# Altium schematic sheet Relay.SchDoc
size A4; Organization: Q-Tech Design; Address1: Da Nang City; Address2: Viet Nam; DocumentNumber: 6; SheetNumber: 6; SheetTotal: 7
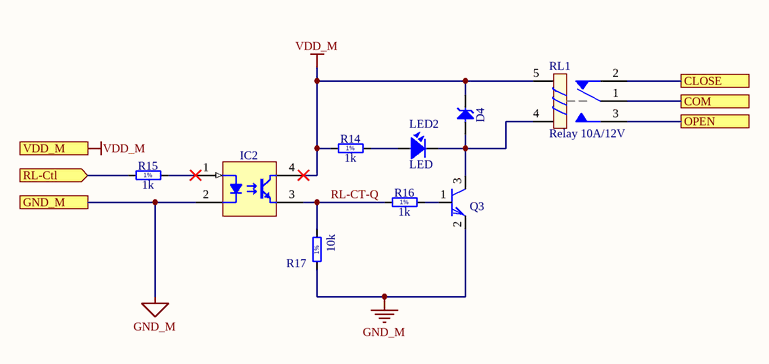
[diagram p0: Relay.SchDoc]

## Parts
D4  BZG03C220  [DIOM5326X230N]  (value not drawn)
IC2  SFH6156-4  [SOIC254P977X406-4N]  (value not drawn)
LED2  LED  [L-0805]
Q3  C1815  [SOT23-3]  (value not drawn)
R14  1k  [RESC1608X55N]
R15  1k  [RESC1608X55N]
R16  1k  [RESC1608X55N]
R17  10k  [RESC1608X55N]
RL1  Relay 10A/12V  [RL_SPDT_10A]

## Ports
CLOSE, COM, GND_M, OPEN, RL-Ctl (in), VDD_M

## Nets
GND_M: IC2.2(C) Q3.2(E) R17.1 ; port GND_M
VDD_M: D4.1(C) IC2.4(C) R14.1 RL1.5 ; port VDD_M
CLOSE: RL1.2 ; port CLOSE
COM: RL1.1 ; port COM
OPEN: RL1.3 ; port OPEN
RL-CT-Q: IC2.3(E) R16.1 R17.2
RL-Ctl: R15.1 ; port RL-Ctl
NetD4_2: D4.2(A) LED2.2 Q3.3(C) RL1.4
NetIC2_1: IC2.1(A) R15.2
NetLED2_1: LED2.1 R14.2
NetQ3_1: Q3.1(B) R16.2

## Notes on the sheet
- Page Title:
- Date:
- Title:
- DRE:
- Time:
- Number:
- Sheet
- Rev:
- of
- Q-Tech confidential and proprietary. Restricted access under NDA. Do not reproduce. Store and dispose securely.
- (in symbol R0603_1K_1%_0.1W_100PPM) 1%
- (in symbol R0603_10K_1%_0.1W_100PPM) 1%
- (in symbol R0603_200R_1%_0.1W_100PPM) 1%

## Library data of the parts
D4 = BZG03C220: Zener Diode; Part Description: Voltage Regulator Diode; Manufacturer: VISHAY SEMICONDUCTOR; Voltage: 220V; Power: 1.25W; Table: Diodes; Part Number: BZG03C220; Component Kind: Standard; Component Type: Standard; Device: BZG03C220; PackageDescription: DO-214-AC/SMA Molded Diode, Body 5.3x2.6mm, IPC Medium Density; Manufacturer Part Number: BZG03C220; Pin Count: 2; Case: DO-214AC; Mounted: Yes; Socket: No; SMD: Yes; ComponentHeight: 2.3mm; HelpURL: \\cern.ch\dfs\Applications\Altium\Datasheets\BZG03C.pdf; Author: CERN DEM JLC; CreateDate: 6/2/2008; LatestRevisionDate: 6/2/2008
IC2 = SFH6156-4: Single Optocoupler; Part Description: Optocoupler, Phototransistor Output, High Reliability, 5300 VRMS; Manufacturer: VISHAY SEMICONDUCTORS; Table: Optocouplers; Part Number: SFH6156-4; Component Kind: Standard; Component Type: Standard; Device: SFH6156-4; PackageDescription: SOIC, 2.54mm pitch; 4 pin, 6.65mm W X 4.69mm L, IPC Medium Density; Manufacturer Part Number: SFH6156-4; Pin Count: 4; Case: SOIC4; Mounted: Yes; Socket: No; SMD: Yes; ComponentHeight: 4.06mm; HelpURL: \\cern.ch\dfs\Applications\Altium\Datasheets\SFH6156-4.pdf; Author: CERN DEM JMW; CreateDate: 22-Jul-09; LatestRevisionDate: 22-Jul-09
LED2 = LED: LED Single colour Green and Red; Value: LED 3 ly Single Colour
Q3 = 2SC1815: PSpiceTemplate: Q^@REFDES %c %b %e @MODEL; Vendor: Digikey; COMPONENT: 2SC1815; Published: 13-April-2009; Publisher: Hoang Nguyen; ComponentLink1Description: Digikey Part Link; ComponentLink2Description: Open Datasheet; ComponentLink2URL: H:\LIBRARY\LIBRARY.Datasheet\; Price: 500VND
R14 R16 = R0603_200R_1%_0.1W_100PPM: Resistor - 1%; Part Description: General Purpose Thick Film Chip Resistor; Manufacturer: GENERIC; Manufacturer1 Part Number: NRC06F2000TRF; Value: 200; Power: 0.1W; TC: ±100ppm/°C; Table: Resistors SMD; Part Number: R0603_200R_1%_0.1W_100PPM; Component Kind: Standard; Component Type: Standard; Pin Count: 2; Status: Preferred; Tolerance: ±1%; Manufacturer Part Number: R0603_200R_1%_0.1W_100PPM; Case: 0603; Mounted: Yes; Socket: No; SMD: Yes; Manufacturer1 Example: NIC COMPONENT; Manufacturer1 ComponentHeight: 0.55mm; HelpURL: \\cern.ch\dfs\Applications\Altium\Datasheets\R0603_NIC_NRC.pdf; Author: CERN DEM JLC; CreateDate: 03-Dec-07; LatestRevisionDate: 13-Mar-08
R15 = R0603_1K_1%_0.1W_100PPM: Resistor - 1%; Part Description: General Purpose Thick Film Chip Resistor; Manufacturer: GENERIC; Manufacturer1 Part Number: NRC06F1001TRF; Power: 0.1W; TC: ±100ppm/°C; Table: Resistors SMD; Part Number: R0603_1K_1%_0.1W_100PPM; Component Kind: Standard; Component Type: Standard; Pin Count: 2; Value: 1k; Status: Preferred; Tolerance: ±1%; Manufacturer Part Number: R0603_1K_1%_0.1W_100PPM; Case: 0603; Mounted: Yes; Socket: No; SMD: Yes; Manufacturer1 Example: NIC COMPONENT; Manufacturer1 ComponentHeight: 0.55mm; HelpURL: \\cern.ch\dfs\Applications\Altium\Datasheets\R0603_NIC_NRC.pdf; Author: CERN DEM JLC; CreateDate: 03-Dec-07; LatestRevisionDate: 13-Mar-08
R17 = R0603_10K_1%_0.1W_100PPM: Resistor - 1%; Part Description: General Purpose Thick Film Chip Resistor; Manufacturer: GENERIC; Manufacturer1 Part Number: NRC06F1002TRF; Power: 0.1W; TC: ±100ppm/°C; Table: Resistors SMD; Part Number: R0603_10K_1%_0.1W_100PPM; Component Kind: Standard; Component Type: Standard; Pin Count: 2; Value: 10k; Status: Preferred; Tolerance: ±1%; Manufacturer Part Number: R0603_10K_1%_0.1W_100PPM; Case: 0603; Mounted: Yes; Socket: No; SMD: Yes; Manufacturer1 Example: NIC COMPONENT; Manufacturer1 ComponentHeight: 0.55mm; HelpURL: \\cern.ch\dfs\Applications\Altium\Datasheets\R0603_NIC_NRC.pdf; Author: CERN DEM JLC; CreateDate: 03-Dec-07; LatestRevisionDate: 13-Mar-08
RL1 = Relay 1: Relay SPDT,10A - 12VDC 5 Pin; Value: Relay SPDT, 10A, 12V